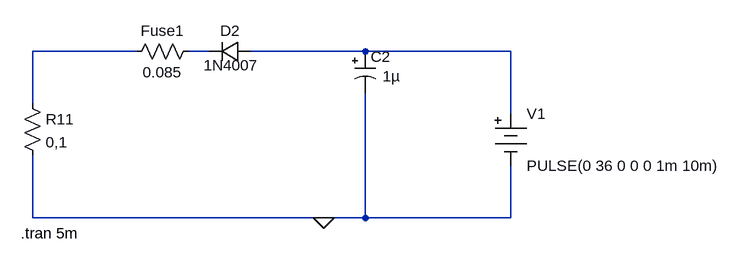
[diagram p0: schematic LM317hc1.asc]
LM317hc1.asc, the LTspice schematic file:
Version 4
SHEET 1 1112 680
WIRE -352 144 -512 144
WIRE -240 144 -272 144
WIRE 0 144 -176 144
WIRE 224 144 0 144
WIRE -512 224 -512 144
WIRE 224 240 224 144
WIRE -512 400 -512 304
WIRE -64 400 -512 400
WIRE 0 400 0 208
WIRE 0 400 -64 400
WIRE 224 400 224 320
WIRE 224 400 0 400
FLAG -64 400 0
SYMBOL diode -176 128 R90
WINDOW 0 0 32 VBottom 2
WINDOW 3 53 30 VBottom 2
SYMATTR InstName D2
SYMATTR Value 1N4007
SYMBOL polcap -16 144 R0
WINDOW 3 43 38 Left 2
SYMATTR Value 1µ
SYMATTR InstName C2
SYMATTR Description Capacitor
SYMATTR Type cap
SYMATTR SpiceLine V=50 Irms=0 Rser=11 Lser=0
SYMBOL res -256 128 R90
WINDOW 0 0 56 VBottom 2
WINDOW 3 32 56 VTop 2
SYMATTR InstName Fuse1
SYMATTR Value 0.085
SYMBOL Misc\\battery 224 224 R0
WINDOW 123 0 0 Left 0
WINDOW 39 0 0 Left 0
SYMATTR InstName V1
SYMATTR Value PULSE(0 36 0 0 0 1m 10m)
SYMBOL res -528 208 R0
SYMATTR InstName R11
SYMATTR Value 0,1
TEXT -530 424 Left 2 !.tran 5m

The netlist it stands for:
* LM317hc1.asc
D2 N003 N002 1N4007
C2 N003 0 1µ V=50 Irms=0 Rser=11 Lser=0
R§Fuse1 N002 N001 0.085
V1 N003 0 PULSE(0 36 0 0 0 1m 10m)
R11 N001 0 0,1
.model D D
.lib standard.dio
.tran 5m
.backanno
.end